# Altium schematic sheet Sheet1.SchDoc
size A4; SheetNumber: 1; SheetTotal: 1
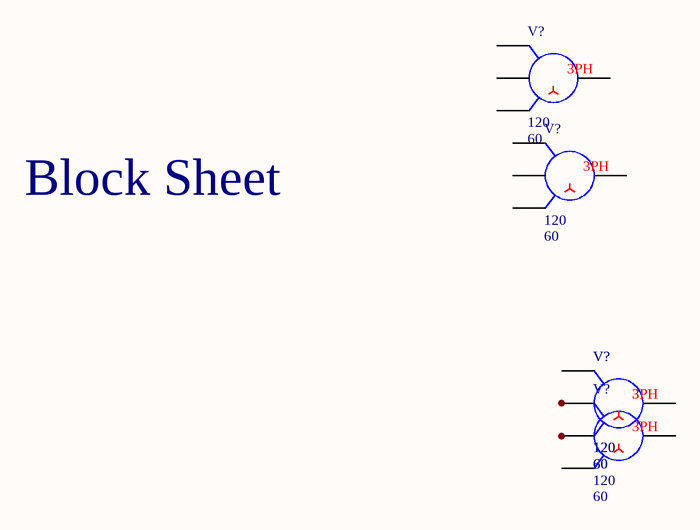
[diagram p0: Sheet1.SchDoc]

## Parts
(Parts that share a designator on the sheet are numbered #1, #2 ... from top to bottom, then left to right.)
V?#1  V_RMS: 120  FREQ: 60  (hidden comment: 3-Phase Wye Voltage Source)
V?#2  V_RMS: 120  FREQ: 60  (hidden comment: 3-Phase Wye Voltage Source)
V?#3  V_RMS: 120  FREQ: 60  (hidden comment: 3-Phase Wye Voltage Source)
V?#4  V_RMS: 120  FREQ: 60  (hidden comment: 3-Phase Wye Voltage Source)
V?#5  V_RMS: 120  FREQ: 60  (hidden comment: 3-Phase Wye Voltage Source)

## Nets
NetV?#3_1: V?#3.1 V?#4.1
NetV?#3_2: V?#3.2 V?#4.2 V?#5.1
NetV?#3_3: V?#3.3 V?#4.3 V?#5.2
NetV?#3_4: V?#3.4 V?#4.4

Not connected (* = marked no-connect by the designer): V?#1 1 2 3 4; V?#2 1 2 3 4; V?#5 3 4

## Notes on the sheet
- Block Sheet
- (in symbol 3 Phase Wye) 3PH

## Library data of the parts
V?#1-V?#5 = 3 Phase Wye: SimulationGenericComponent: True